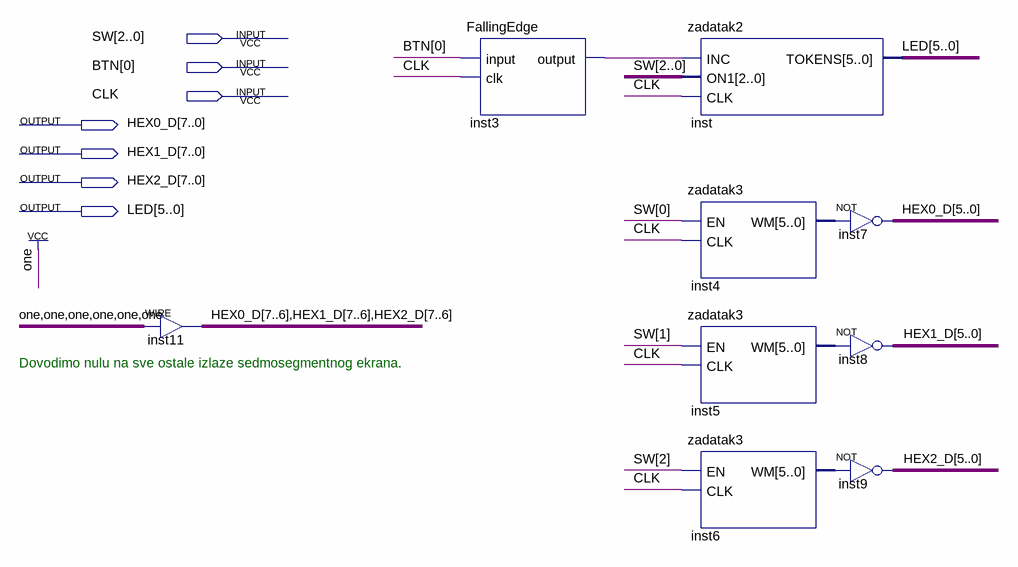
[diagram p0: schematic sheet]
// Quartus schematic zadatak4.bdf as structural Verilog: 9 symbols, 7 pins
module zadatak4 (
  input  [2:0] SW,
  input  [0:0] BTN,
  input  CLK,
  output [7:0] HEX0_D,
  output [7:0] HEX1_D,
  output [7:0] HEX2_D,
  output [5:0] LED
);

  wire inst3_output;
  wire [5:0] inst4_wm, inst5_wm, inst6_wm;

  assign {HEX0_D[7:6], HEX1_D[7:6], HEX2_D[7:6]} = {6{1'b1}};  // WIRE inst11
  FallingEdge inst3 (.\input (BTN[0]), .clk(CLK), .\output (inst3_output));
  zadatak2 inst (.INC(inst3_output), .ON1(SW), .CLK(CLK), .TOKENS(LED));
  zadatak3 inst4 (.EN(SW[0]), .CLK(CLK), .WM(inst4_wm));
  zadatak3 inst5 (.EN(SW[1]), .CLK(CLK), .WM(inst5_wm));
  zadatak3 inst6 (.EN(SW[2]), .CLK(CLK), .WM(inst6_wm));
  assign HEX0_D[5:0] = ~inst4_wm;  // NOT inst7, 6 bits wide
  assign HEX1_D[5:0] = ~inst5_wm;  // NOT inst8, 6 bits wide
  assign HEX2_D[5:0] = ~inst6_wm;  // NOT inst9, 6 bits wide

  // Notes on the sheet:
  //   Dovodimo nulu na sve ostale izlaze sedmosegmentnog ekrana.
endmodule
